# EAGLE design schem (EAGLE 7.6.0)
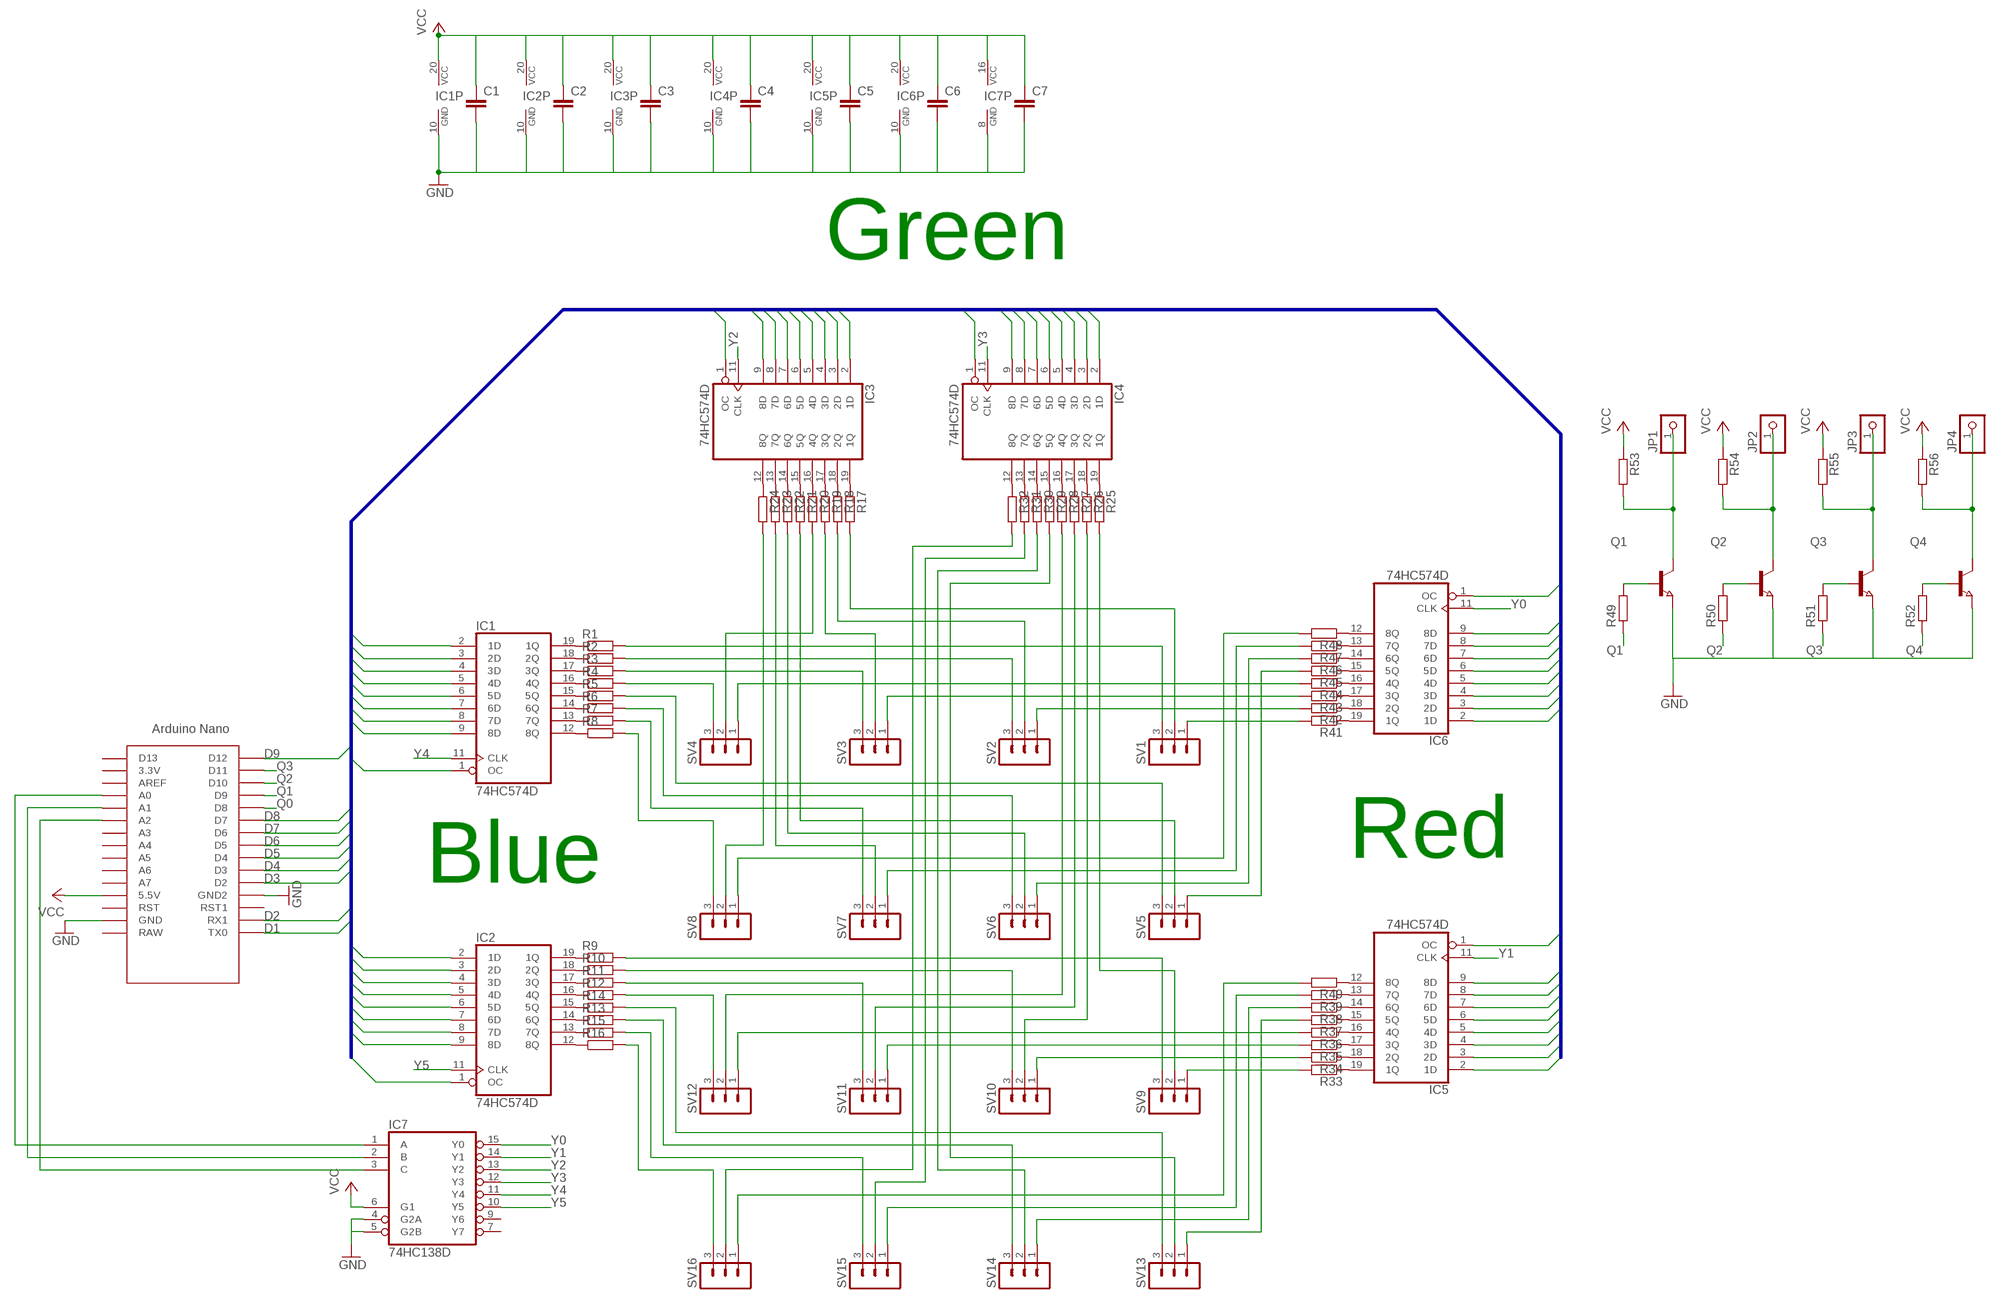
[diagram p0: schematic, sheet 1]

## Parts
C1  C-EUC0805  [C0805]
C2  C-EUC0805  [C0805]
C3  C-EUC0805  [C0805]
C4  C-EUC0805  [C0805]
C5  C-EUC0805  [C0805]
C6  C-EUC0805  [C0805]
C7  C-EUC0805  [C0805]
IC1  74HC574D  [SO20W]
IC2  74HC574D  [SO20W]
IC3  74HC574D  [SO20W]
IC4  74HC574D  [SO20W]
IC5  74HC574D  [SO20W]
IC6  74HC574D  [SO20W]
IC7  74HC138D  [SO16]
JP1  PINHD-1X1  [1X01]
JP2  PINHD-1X1  [1X01]
JP3  PINHD-1X1  [1X01]
JP4  PINHD-1X1  [1X01]
Q1  NPN-TRANSISTOR_SOT23  [SOT23]
Q2  NPN-TRANSISTOR_SOT23  [SOT23]
Q3  NPN-TRANSISTOR_SOT23  [SOT23]
Q4  NPN-TRANSISTOR_SOT23  [SOT23]
R1  R-EU_R0805  [R0805]
R2  R-EU_R0805  [R0805]
R3  R-EU_R0805  [R0805]
R4  R-EU_R0805  [R0805]
R5  R-EU_R0805  [R0805]
R6  R-EU_R0805  [R0805]
R7  R-EU_R0805  [R0805]
R8  R-EU_R0805  [R0805]
R9  R-EU_R0805  [R0805]
R10  R-EU_R0805  [R0805]
R11  R-EU_R0805  [R0805]
R12  R-EU_R0805  [R0805]
R13  R-EU_R0805  [R0805]
R14  R-EU_R0805  [R0805]
R15  R-EU_R0805  [R0805]
R16  R-EU_R0805  [R0805]
R17  R-EU_R0805  [R0805]
R18  R-EU_R0805  [R0805]
R19  R-EU_R0805  [R0805]
R20  R-EU_R0805  [R0805]
R21  R-EU_R0805  [R0805]
R22  R-EU_R0805  [R0805]
R23  R-EU_R0805  [R0805]
R24  R-EU_R0805  [R0805]
R25  R-EU_R0805  [R0805]
R26  R-EU_R0805  [R0805]
R27  R-EU_R0805  [R0805]
R28  R-EU_R0805  [R0805]
R29  R-EU_R0805  [R0805]
R30  R-EU_R0805  [R0805]
R31  R-EU_R0805  [R0805]
R32  R-EU_R0805  [R0805]
R33  R-EU_R0805  [R0805]
R34  R-EU_R0805  [R0805]
R35  R-EU_R0805  [R0805]
R36  R-EU_R0805  [R0805]
R37  R-EU_R0805  [R0805]
R38  R-EU_R0805  [R0805]
R39  R-EU_R0805  [R0805]
R40  R-EU_R0805  [R0805]
R41  R-EU_R0805  [R0805]
R42  R-EU_R0805  [R0805]
R43  R-EU_R0805  [R0805]
R44  R-EU_R0805  [R0805]
R45  R-EU_R0805  [R0805]
R46  R-EU_R0805  [R0805]
R47  R-EU_R0805  [R0805]
R48  R-EU_R0805  [R0805]
R49  R-EU_R0805  [R0805]
R50  R-EU_R0805  [R0805]
R51  R-EU_R0805  [R0805]
R52  R-EU_R0805  [R0805]
R53  R-EU_R0805  [R0805]
R54  R-EU_R0805  [R0805]
R55  R-EU_R0805  [R0805]
R56  R-EU_R0805  [R0805]
SV1  MA03-1  [MA03-1]
SV2  MA03-1  [MA03-1]
SV3  MA03-1  [MA03-1]
SV4  MA03-1  [MA03-1]
SV5  MA03-1  [MA03-1]
SV6  MA03-1  [MA03-1]
SV7  MA03-1  [MA03-1]
SV8  MA03-1  [MA03-1]
SV9  MA03-1  [MA03-1]
SV10  MA03-1  [MA03-1]
SV11  MA03-1  [MA03-1]
SV12  MA03-1  [MA03-1]
SV13  MA03-1  [MA03-1]
SV14  MA03-1  [MA03-1]
SV15  MA03-1  [MA03-1]
SV16  MA03-1  [MA03-1]
U$1  NANO  [NANO]

## Nets
D1: IC1.2(1D) IC2.2(1D) IC3.2(1D) IC4.2(1D) IC5.2(1D) IC6.2(1D) U$1.TX0
D2: IC1.3(2D) IC2.3(2D) IC3.3(2D) IC4.3(2D) IC5.3(2D) IC6.3(2D) U$1.RX1
D3: IC1.4(3D) IC2.4(3D) IC3.4(3D) IC4.4(3D) IC5.4(3D) IC6.4(3D) U$1.D2
D4: IC1.5(4D) IC2.5(4D) IC3.5(4D) IC4.5(4D) IC5.5(4D) IC6.5(4D) U$1.D3
D5: IC1.6(5D) IC2.6(5D) IC3.6(5D) IC4.6(5D) IC5.6(5D) IC6.6(5D) U$1.D4
D6: IC1.7(6D) IC2.7(6D) IC3.7(6D) IC4.7(6D) IC5.7(6D) IC6.7(6D) U$1.D5
D7: IC1.8(7D) IC2.8(7D) IC3.8(7D) IC4.8(7D) IC5.8(7D) IC6.8(7D) U$1.D6
D8: IC1.9(8D) IC2.9(8D) IC3.9(8D) IC4.9(8D) IC5.9(8D) IC6.9(8D) U$1.D7
D9: IC1.1(OC) IC2.1(OC) IC3.1(OC) IC4.1(OC) IC5.1(OC) IC6.1(OC) U$1.D12
GND: C1.2 C2.2 C3.2 C4.2 C5.2 C6.2 C7.2 IC1.10(GND) IC2.10(GND) IC3.10(GND) IC4.10(GND) IC5.10(GND) IC6.10(GND) IC7.4(G2A) IC7.5(G2B) IC7.8(GND) Q1.2(E) Q2.2(E) Q3.2(E) Q4.2(E) U$1.GND U$1.GND1(GND2)
N$1: IC1.19(1Q) R1.1
N$2: IC1.18(2Q) R2.1
N$3: IC1.17(3Q) R3.1
N$4: IC1.16(4Q) R4.1
N$5: IC1.15(5Q) R5.1
N$6: IC1.14(6Q) R6.1
N$7: IC1.13(7Q) R7.1
N$8: IC1.12(8Q) R8.1
N$9: IC2.19(1Q) R9.1
N$10: IC2.18(2Q) R10.1
N$11: IC2.17(3Q) R11.1
N$12: IC2.16(4Q) R12.1
N$13: IC2.14(6Q) R13.1
N$14: IC2.15(5Q) R14.1
N$15: IC2.13(7Q) R15.1
N$16: IC2.12(8Q) R16.1
N$17: IC3.19(1Q) R17.1
N$18: IC3.18(2Q) R18.1
N$19: IC3.17(3Q) R19.1
N$20: IC3.16(4Q) R20.1
N$21: IC3.15(5Q) R21.1
N$22: IC3.14(6Q) R22.1
N$23: IC3.13(7Q) R23.1
N$24: IC3.12(8Q) R24.1
N$25: IC4.19(1Q) R25.1
N$26: IC4.18(2Q) R26.1
N$27: IC4.17(3Q) R27.1
N$28: IC4.16(4Q) R28.1
N$29: IC4.15(5Q) R29.1
N$30: IC4.14(6Q) R30.1
N$31: IC4.13(7Q) R31.1
N$32: IC4.12(8Q) R32.1
N$33: IC5.19(1Q) R33.1
N$34: IC5.18(2Q) R34.1
N$35: IC5.17(3Q) R35.1
N$36: IC5.16(4Q) R36.1
N$37: IC5.15(5Q) R37.1
N$38: IC5.14(6Q) R38.1
N$39: IC5.13(7Q) R39.1
N$40: IC5.12(8Q) R40.1
N$41: IC6.19(1Q) R41.1
N$42: IC6.18(2Q) R42.1
N$43: IC6.17(3Q) R43.1
N$44: IC6.16(4Q) R44.1
N$45: IC6.15(5Q) R45.1
N$46: IC6.14(6Q) R46.1
N$47: IC6.13(7Q) R47.1
N$48: IC6.12(8Q) R48.1
N$49: R1.2 SV1.3
N$50: R2.2 SV2.3
N$51: R3.2 SV3.3
N$52: R4.2 SV4.3
N$53: R5.2 SV5.3
N$54: R6.2 SV6.3
N$55: R7.2 SV7.3
N$56: R8.2 SV8.3
N$57: R17.2 SV1.2
N$58: R18.2 SV2.2
N$59: R19.2 SV3.2
N$60: R20.2 SV4.2
N$61: R21.2 SV5.2
N$62: R22.2 SV6.2
N$63: R23.2 SV7.2
N$64: R24.2 SV8.2
N$65: R44.2 SV4.1
N$66: R43.2 SV3.1
N$67: R42.2 SV2.1
N$68: R41.2 SV1.1
N$69: R48.2 SV8.1
N$70: R9.2 SV9.3
N$71: R47.2 SV7.1
N$72: R46.2 SV6.1
N$73: R45.2 SV5.1
N$74: R10.2 SV10.3
N$75: R11.2 SV11.3
N$76: R12.2 SV12.3
N$77: R28.2 SV12.2
N$78: R27.2 SV11.2
N$79: R26.2 SV10.2
N$80: R25.2 SV9.2
N$81: R36.2 SV12.1
N$82: R35.2 SV11.1
N$83: R34.2 SV10.1
N$84: R33.2 SV9.1
N$85: R14.2 SV13.3
N$86: R13.2 SV14.3
N$87: R15.2 SV15.3
N$88: R16.2 SV16.3
N$89: R32.2 SV16.2
N$90: R31.2 SV15.2
N$91: R30.2 SV14.2
N$92: R29.2 SV13.2
N$93: R40.2 SV16.1
N$94: R39.2 SV15.1
N$95: R38.2 SV14.1
N$96: R37.2 SV13.1
N$97: IC7.1(A) U$1.A0
N$98: JP1.1 Q1.3(C) R53.2
N$99: JP2.1 Q2.3(C) R54.2
N$100: JP3.1 Q3.3(C) R55.2
N$101: JP4.1 Q4.3(C) R56.2
N$102: Q1.1(B) R49.2
N$103: Q2.1(B) R50.2
N$104: Q3.1(B) R51.2
N$105: Q4.1(B) R52.2
N$106: IC7.2(B) U$1.A1
N$107: IC7.3(C) U$1.A2
Q0: U$1.D8
Q1: R49.1 U$1.D9
Q2: R50.1 U$1.D10
Q3: R51.1 U$1.D11
Q4: R52.1
VCC: C1.1 C2.1 C3.1 C4.1 C5.1 C6.1 C7.1 IC1.20(VCC) IC2.20(VCC) IC3.20(VCC) IC4.20(VCC) IC5.20(VCC) IC6.20(VCC) IC7.6(G1) IC7.16(VCC) R53.1 R54.1 R55.1 R56.1 U$1.5V(5.5V)
Y0: IC6.11(CLK) IC7.15(Y0)
Y1: IC5.11(CLK) IC7.14(Y1)
Y2: IC3.11(CLK) IC7.13(Y2)
Y3: IC4.11(CLK) IC7.12(Y3)
Y4: IC1.11(CLK) IC7.11(Y4)
Y5: IC2.11(CLK) IC7.10(Y5)
Unconnected: IC7.7(Y7) IC7.9(Y6) U$1.3.3V U$1.A3 U$1.A4 U$1.A5 U$1.A6 U$1.A7 U$1.AREF U$1.D13 U$1.ICSP1 U$1.ICSP2 U$1.ICSP3 U$1.ICSP4 U$1.ICSP5 U$1.ICSP6 U$1.RAW U$1.RST U$1.RST1

## Buses
D[1..9]

## Notes on the sheet
- Green
- Red
- Blue

## Library data of the parts
C1-C7 = resistor:C-EU: CAPACITOR, European symbol
IC1-IC6 = 74xx-eu:74*574: 8-bit D type FLIP FLOP bus driver
IC7 = 74xx-eu:74*138: 3-line to 8-line DECODER/DEMULTIPLEXER
JP1-JP4 = pinhead:PINHD-1X1: PIN HEADER
Q1-Q4 = semicon-smd-ipc:NPN-TRANSISTOR_: NPN TRANSISTOR
R1-R56 = resistor:R-EU_: RESISTOR, European symbol
SV1-SV16 = con-lstb:MA03-1: PIN HEADER; OC_FARNELL: unknown; OC_NEWARK: unknown
U$1 = Arduino-clone:NANO: Arduino Nano

## Board
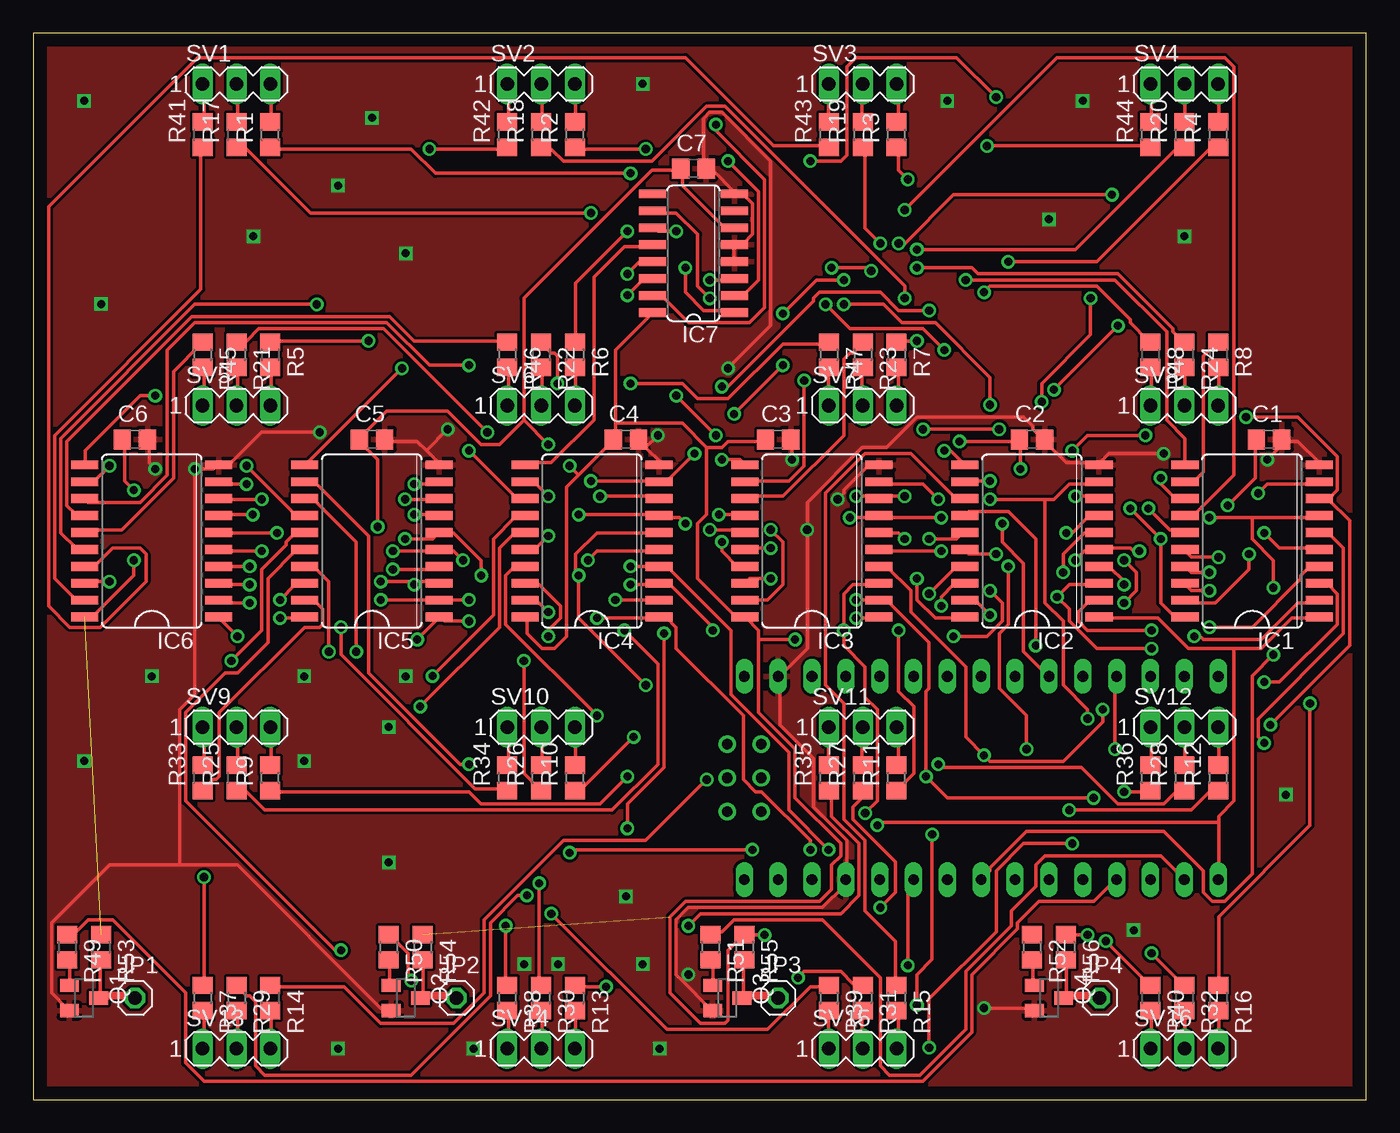
[diagram p1: board, top side]
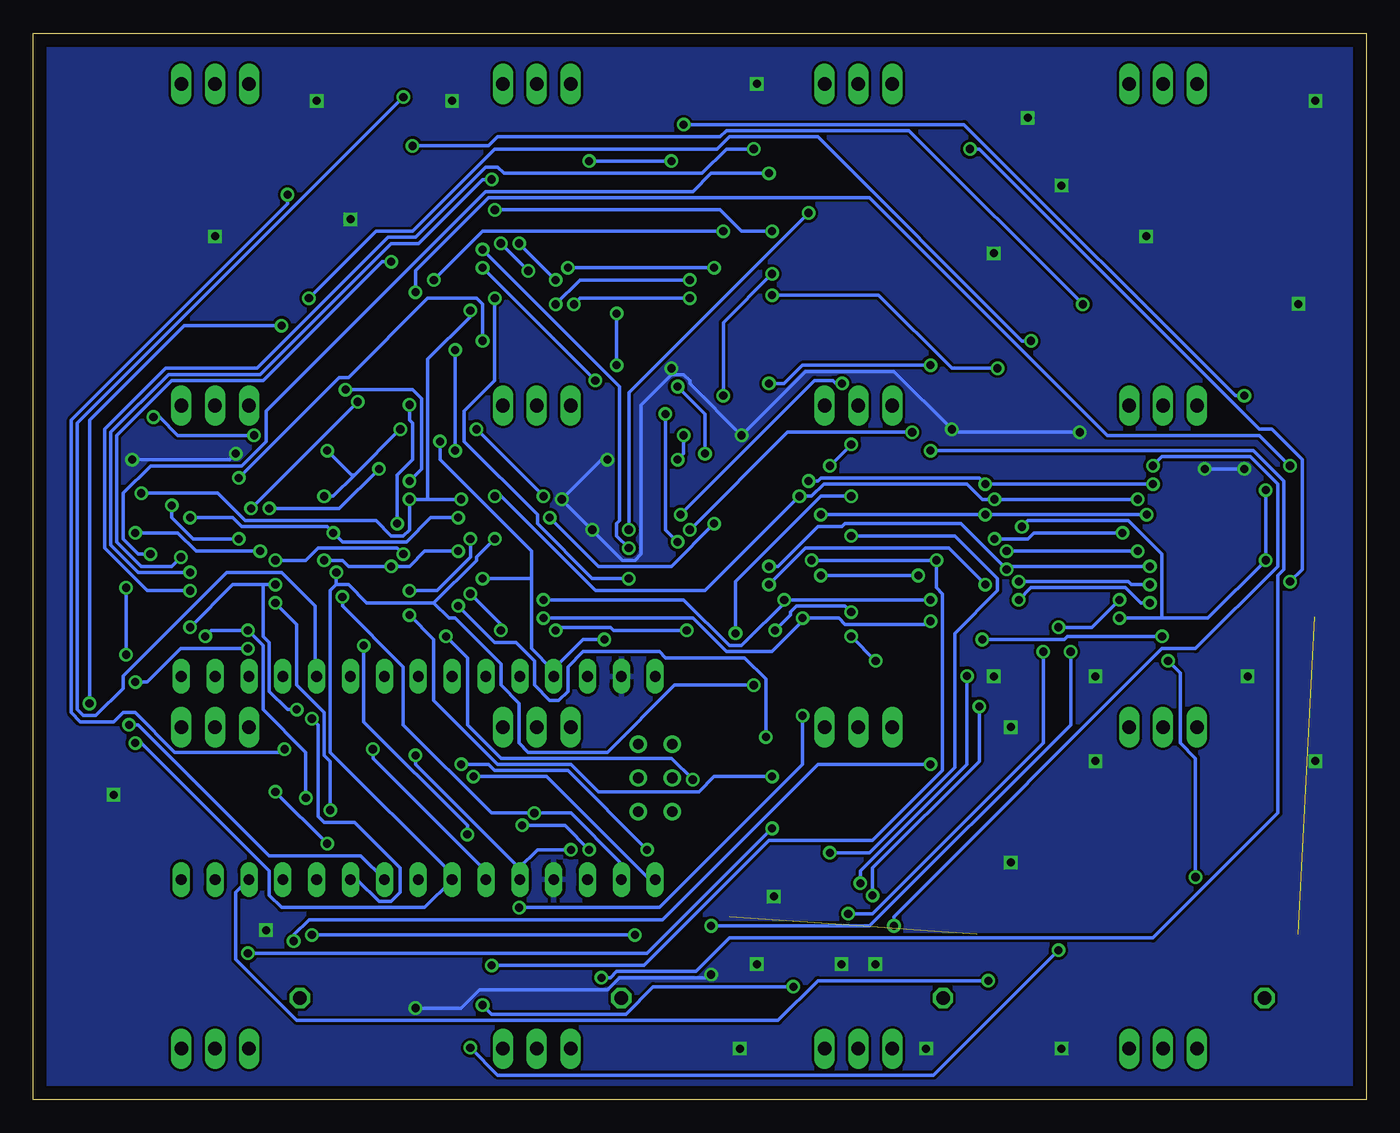
[diagram p2: board, bottom side, seen from below]

Size 100 x 80 mm. Coordinates in mm from the lower left corner, seen from the top.
Outline: 0,0 100,0 100,80 0,80 0,0
Copper layers (1*16): Top 0.035mm / dielectric 1.5mm / Bottom 0.035mm
Design rules "default *": minimum track width 10mil, minimum drill 24mil, track to track 8mil, track to pad 8mil, pad to pad 8mil, via to via 8mil, smd to smd 8mil, copper to edge 40mil, drill to drill 8mil, minimum pad ring 10mil, minimum via ring 8mil, stop-mask expansion 4mil, vias tented up to drill 0mil, thermal gap 10mil

### Footprints (pad centres in the part's own frame; a part is rotated, then mirrored left to right if it is on the bottom)
C0805 = smd 1.3 x 1.5: 1 -0.95,0; 2 0.95,0
SO20W = smd 0.66 x 2.032: 1 -5.715,-5.029; 2 -4.445,-5.029; 3 -3.175,-5.029; 4 -1.905,-5.029; 5 -0.635,-5.029; 6 0.635,-5.029; 7 1.905,-5.029; 8 3.175,-5.029; 9 4.445,-5.029; 10 5.715,-5.029; 11 5.715,5.029; 12 4.445,5.029; 13 3.175,5.029; 14 1.905,5.029; 15 0.635,5.029; 16 -0.635,5.029; 17 -1.905,5.029; 18 -3.175,5.029; 19 -4.445,5.029; 20 -5.715,5.029
SO16 = smd 0.66 x 2.032: 1 -4.445,-3.073; 2 -3.175,-3.073; 3 -1.905,-3.073; 4 -0.635,-3.073; 5 0.635,-3.073; 6 1.905,-3.073; 7 3.175,-3.073; 8 4.445,-3.073; 9 4.445,3.073; 10 3.175,3.073; 11 1.905,3.073; 12 0.635,3.073; 13 -0.635,3.073; 14 -1.905,3.073; 15 -3.175,3.073; 16 -4.445,3.073
1X01 = drill 1.016 octagon: 1 0,0
SOT23 = smd 1 x 1.4: 1 -0.95,-1.1; 2 0.95,-1.1; 3 0,1.1
R0805 = smd 1.3 x 1.5: 1 -0.95,0; 2 0.95,0
MA03-1 = drill 1.016 long: 1 -2.54,0; 2 0,0; 3 2.54,0
NANO = drill 0.8 long: 3.3V -10.16,24.13; 5V -10.16,-1.27; A0 -10.16,19.05; A1 -10.16,16.51; A2 -10.16,13.97; A3 -10.16,11.43; A4 -10.16,8.89; A5 -10.16,6.35; A6 -10.16,3.81; A7 -10.16,1.27; AREF -10.16,21.59; D2 5.08,1.27; D3 5.08,3.81; D4 5.08,6.35; D5 5.08,8.89; D6 5.08,11.43; D7 5.08,13.97; D8 5.08,16.51; D9 5.08,19.05; D10 5.08,21.59; D11 5.08,24.13; D12 5.08,26.67; D13 -10.16,26.67; GND -10.16,-6.35; GND1 5.08,-1.27; RAW -10.16,-8.89; RST -10.16,-3.81; RST1 5.08,-3.81; RX1 5.08,-6.35; TX0 5.08,-8.89 | drill 0.8: ICSP1 -5.08,-10.16; ICSP2 -5.08,-7.62; ICSP3 -2.54,-10.16; ICSP4 -2.54,-7.62; ICSP5 0,-10.16; ICSP6 0,-7.62

### Placement (x,y rotation side)
C1  92.71,49.53 0 top
C2  74.93,49.53 0 top
C3  55.88,49.53 0 top
C4  44.45,49.53 0 top
C5  25.4,49.53 0 top
C6  7.62,49.53 0 top
C7  49.53,69.85 0 top
IC1  91.44,41.91 90 top
IC2  74.93,41.91 90 top
IC3  58.42,41.91 90 top
IC4  41.91,41.91 90 top
IC5  25.4,41.91 90 top
IC6  8.89,41.91 90 top
IC7  49.53,63.5 90 top
JP1  7.62,7.62 0 top
JP2  31.75,7.62 0 top
JP3  55.88,7.62 0 top
JP4  80.01,7.62 0 top
Q1  3.81,7.62 270 top
Q2  27.94,7.62 270 top
Q3  52.07,7.62 270 top
Q4  76.2,7.62 270 top
R1  17.78,72.39 90 top
R2  40.64,72.39 90 top
R3  64.77,72.39 90 top
R4  88.9,72.39 90 top
R5  17.78,55.88 270 top
R6  40.64,55.88 270 top
R7  64.77,55.88 270 top
R8  88.9,55.88 270 top
R9  17.78,24.13 90 top
R10  40.64,24.13 90 top
R11  64.77,24.13 90 top
R12  88.9,24.13 90 top
R13  40.64,7.62 270 top
R14  17.78,7.62 270 top
R15  64.77,7.62 270 top
R16  88.9,7.62 270 top
R17  15.24,72.39 90 top
R18  38.1,72.39 90 top
R19  62.23,72.39 90 top
R20  86.36,72.39 90 top
R21  15.24,55.88 270 top
R22  38.1,55.88 270 top
R23  62.23,55.88 270 top
R24  86.36,55.88 270 top
R25  15.24,24.13 90 top
R26  38.1,24.13 90 top
R27  62.23,24.13 90 top
R28  86.36,24.13 90 top
R29  15.24,7.62 270 top
R30  38.1,7.62 270 top
R31  62.23,7.62 270 top
R32  86.36,7.62 270 top
R33  12.7,24.13 90 top
R34  35.56,24.13 90 top
R35  59.69,24.13 90 top
R36  83.82,24.13 90 top
R37  12.7,7.62 270 top
R38  35.56,7.62 270 top
R39  59.69,7.62 270 top
R40  83.82,7.62 270 top
R41  12.7,72.39 90 top
R42  35.56,72.39 90 top
R43  59.69,72.39 90 top
R44  83.82,72.39 90 top
R45  12.7,55.88 270 top
R46  35.56,55.88 270 top
R47  59.69,55.88 270 top
R48  83.82,55.88 270 top
R49  2.54,11.43 270 top
R50  26.67,11.43 270 top
R51  50.8,11.43 270 top
R52  74.93,11.43 270 top
R53  5.08,11.43 270 top
R54  29.21,11.43 270 top
R55  53.34,11.43 270 top
R56  77.47,11.43 270 top
SV1  15.24,76.2 0 top
SV2  38.1,76.2 0 top
SV3  62.23,76.2 0 top
SV4  86.36,76.2 0 top
SV5  15.24,52.07 0 top
SV6  38.1,52.07 0 top
SV7  62.23,52.07 0 top
SV8  86.36,52.07 0 top
SV9  15.24,27.94 0 top
SV10  38.1,27.94 0 top
SV11  62.23,27.94 0 top
SV12  86.36,27.94 0 top
SV13  15.24,3.81 0 top
SV14  38.1,3.81 0 top
SV15  62.23,3.81 0 top
SV16  86.36,3.81 0 top
U$1  62.23,21.59 270 top

### Tracks (layer width: path | path; a pad name or v marks a point on that pad's centre or on a via)
D1  (via drill 0.61)
  Top 0.254: v83.9,35.2 79.1,35.2 78.41,35.89 78.41,36.58 79.1,37.26 79.78,37.26 IC2.2 | v87.1,34.75 87.55,34.75 87.78,34.52 92.13,34.52 94.87,37.26 96.47,37.26 IC1.2 | v16.23,37.26 13.95,37.26 IC6.2 | v26.06,37.49 30.4,37.49 IC5.2 30.63,37.49 v32.69,37.49 | v43.66,37.49 46.86,37.49 IC4.2 | v61.72,37.49 63.32,37.49 IC3.2 63.55,37.26 64.24,37.26 67.21,34.29 67.21,30.86 66.98,30.63 v66.98,24.23 68.58,22.63 v79.55,22.63
  Bottom 0.254: v87.1,34.75 86.64,35.2 v83.9,35.2 82.75,34.06 82.75,29.26 79.55,26.06 v79.55,22.63 | v16.23,37.26 16.92,37.26 18.06,38.41 25.15,38.41 v26.06,37.49 | v32.69,37.49 43.43,37.49 | v61.72,37.49 51.21,37.49 47.78,34.06 46.86,34.06 43.43,37.49 | 43.43,37.49 v43.66,37.49 | v66.98,24.23 61.49,24.23 53.95,16.69 53.49,16.69 U$1.TX0
D2  (via drill 0.61)
  Top 0.254: v16.23,38.63 13.95,38.63 IC6.3 | 28.57,38.86 30.4,38.86 IC5.3 | 28.57,38.86 v26.06,38.86 | v44.81,38.63 46.86,38.63 IC4.3 47.09,38.63 47.78,38.63 50.98,35.43 v50.98,35.2 | 28.57,38.86 v28.57,38.63 | v62.41,21.49 63.32,22.4 63.32,29.26 62.41,30.18 62.41,32.46 60.81,34.06 v60.81,35.2 60.81,37.95 61.49,38.63 63.32,38.63 IC3.3 | IC2.3 79.78,38.63 77.72,38.63 v76.81,37.72 77.72,36.8 77.72,35.89 79.78,33.83 v83.9,33.83 | v92.35,31.32 93.5,31.32 97.84,35.66 97.84,37.95 97.16,38.63 96.47,38.63 IC1.3
  Bottom 0.254: v16.23,38.63 17.6,38.63 17.83,38.86 v26.06,38.86 | v44.81,38.63 42.06,41.38 31.32,41.38 v28.57,38.63 | U$1.RX1 56.01,16.69 56.01,17.83 59.66,21.49 v62.41,21.49 65.61,21.49 72.24,28.12 72.24,32.46 76.81,37.03 v76.81,37.72 | v92.35,31.32 91.44,31.32 88.92,33.83 v83.9,33.83 | v50.98,35.2 56.46,35.2 56.69,35.43 60.58,35.43 v60.81,35.2
D3  (via drill 0.61)
  Top 0.254: v16.23,40.01 IC6.4 | v26.98,39.78 30.18,39.78 30.4,40.01 IC5.4 | v44.81,40.01 IC4.4 47.55,40.01 52.35,35.2 52.35,30.4 56.69,26.06 56.69,21.72 v59.66,18.75 | IC2.4 80.7,40.01 81.84,38.86 v81.84,38.63 | v88.24,35.43 91.44,35.43 95.1,39.09 95.1,39.32 95.78,40.01 IC1.4 | IC3.4 64.01,40.01 65.84,38.18 65.84,36.58 69.95,32.46 69.95,27.2 v71.32,25.83 71.78,25.38 77.27,25.38 80.24,28.35 v80.24,29.26
  Bottom 0.254: v16.23,40.01 26.75,40.01 v26.98,39.78 30.4,43.2 39.09,43.2 39.32,42.98 41.15,42.98 44.12,40.01 v44.81,40.01 | 82.75,38.63 85.04,38.63 v88.24,35.43 | 82.75,38.63 v81.84,38.63 | v71.32,25.83 71.32,25.15 63.55,17.37 | 63.55,17.37 63.55,16.69 U$1.D2 63.55,17.37 | 82.75,38.63 82.75,34.75 82.3,34.29 82.3,30.63 80.92,29.26 v80.24,29.26 | v59.66,18.75 62.18,18.75 63.55,17.37
D4  (via drill 0.61)
  Top 0.254: v17.14,41.15 13.95,41.15 IC6.5 | v26.98,41.15 30.4,41.15 IC5.5 30.63,41.15 31.55,41.15 v32.23,40.46 | v41.6,40.46 42.29,41.15 46.86,41.15 IC4.5 | v68.12,41.15 63.55,41.15 IC3.5 | v78.18,40.46 78.87,41.15 79.78,41.15 IC2.5 80.01,41.38 82.3,41.38 82.53,41.15 v82.98,41.15 | v92.35,42.52 93.5,41.38 96.47,41.38 IC1.5 | v74.52,26.29 74.52,28.8 72.47,30.86 72.47,34.98 73.15,35.66 v73.15,40.01 | v65.61,10.06 65.61,16.23 65.84,16.46 U$1.D3
  Bottom 0.254: v26.98,41.15 v17.14,41.15 | v41.6,40.46 v32.23,40.46 32.23,38.41 31.77,37.95 31.77,24.69 37.03,19.43 44.81,19.43 54.18,10.06 v65.61,10.06 | v68.12,41.15 70.64,41.15 71.78,40.01 v73.15,40.01 76.35,40.01 76.81,40.46 v78.18,40.46 | v92.35,42.52 89.15,42.52 87.78,41.15 v82.98,41.15 | v74.52,26.29 74.52,25.6 66.06,17.14 66.06,16.69 U$1.D3
D5  (via drill 0.61)
  Top 0.254: v18.29,42.52 13.95,42.52 IC6.6 | v27.89,42.06 29.95,42.06 IC5.6 30.63,42.52 31.55,42.52 33.6,40.46 v33.6,39.32 | IC4.6 46.86,42.52 42.29,42.52 40.69,40.92 40.69,39.55 v40.92,39.32 40.92,36.12 v45.95,31.09 | v65.38,42.06 64.92,42.52 63.55,42.52 IC3.6 | v77.27,39.55 77.27,40.92 78.87,42.52 79.78,42.52 IC2.6 | v92.35,26.75 91.9,27.2 91.9,28.57 98.3,34.98 98.3,41.38 97.16,42.52 96.47,42.52 IC1.6
  Bottom 0.254: v18.29,42.52 24.92,42.52 25.38,42.06 v27.89,42.06 | v33.6,39.32 v40.92,39.32 | v65.38,42.06 66.75,40.69 66.75,40.46 69.95,37.26 | 69.95,37.26 74.98,37.26 76.35,38.63 77.27,38.63 | 77.27,38.63 77.72,38.18 77.72,26.06 68.58,16.92 U$1.D4 68.58,16.46 70.64,14.4 81.38,14.4 82.3,15.32 82.3,17.14 91.9,26.75 v92.35,26.75 | 77.27,38.63 v77.27,39.55 | v45.95,31.09 51.89,31.09 56.92,26.06 62.87,26.06 63.55,26.75 63.55,29.72 64.92,31.09 64.92,32.69 68.35,36.12 68.81,36.12 69.95,37.26
D6  (via drill 0.61)
  Top 0.254: v16.46,43.89 13.95,43.89 IC6.7 | v28.57,43.89 30.4,43.89 IC5.7 | v40.92,43.89 46.86,43.89 IC4.7 47.09,43.66 48.46,43.66 v48.92,43.2 | v68.12,43.66 63.55,43.66 IC3.7 63.32,43.66 v61.27,43.66 | v77.5,42.52 77.95,42.52 79.1,43.66 79.78,43.66 IC2.7 | v88.24,43.66 91.44,43.66 | 91.44,43.66 96.47,43.66 IC1.7 | v93.04,33.38 91.44,31.77 91.44,16.92 89.38,14.86 88.47,14.86 87.78,15.54 87.78,17.14 84.81,20.12 74.52,20.12 71.78,17.37 71.78,17.14 71.32,16.69 U$1.D5 | v93.04,38.41 93.04,40.46 91.44,42.06 91.44,43.66
  Bottom 0.254: v16.46,43.89 v28.57,43.89 v40.92,43.89 | v68.12,43.66 70.18,43.66 72.01,41.83 76.81,41.83 v77.5,42.52 77.95,42.98 84.35,42.98 85.04,43.66 v88.24,43.66 | v93.04,38.41 v93.04,33.38 | v48.92,43.2 52.12,40.01 57.61,40.01 v61.27,43.66
D7  (via drill 0.61)
  Top 0.254: 97.16,45.03 96.47,45.03 IC1.8 97.16,45.03 | 97.16,45.03 98.75,43.43 98.75,34.06 v92.81,28.12 | v17.14,45.03 13.95,45.03 IC6.8 | v27.89,45.03 30.4,45.03 IC5.8 | v42.52,45.26 46.86,45.26 IC4.8 | v65.38,45.26 63.55,45.26 IC3.8 63.32,45.26 v61.72,45.26 | v78.18,45.26 79.78,45.26 IC2.8 | v66.75,50.29 v72.47,50.29 | 97.16,45.03 97.84,45.72 97.84,48.23 94.87,51.21 v90.98,51.21 | v83.44,49.84 79.1,49.84 v77.95,48.69
  Bottom 0.254: v92.81,28.12 92.13,28.12 82.3,18.29 75.44,18.29 U$1.D6 | v17.14,45.03 v27.89,45.03 28.8,45.03 29.95,46.18 40.69,46.18 41.6,45.26 v42.52,45.26 49.61,38.18 57.84,38.18 64.92,45.26 v65.38,45.26 | v78.18,45.26 77.5,45.26 75.89,46.86 | v72.47,50.29 75.89,46.86 | v61.72,45.26 v66.75,50.29 | v90.98,51.21 90.53,51.21 89.15,49.84 v83.44,49.84 | v77.95,48.69 76.12,46.86 75.89,46.86
D8  (via drill 0.61)
  Top 0.254: v16,46.18 13.95,46.18 IC6.9 | v28.57,46.18 30.4,46.18 IC5.9 | v41.83,46.41 46.86,46.41 IC4.9 47.09,46.41 47.55,46.41 v49.61,48.46 | v67.89,45.03 66.75,46.18 63.55,46.18 IC3.9 | 75.89,45.03 76.58,45.03 77.72,46.18 79.78,46.18 IC2.9 | 75.89,45.03 v71.78,45.03 | v91.9,45.49 92.58,46.18 96.47,46.18 IC1.9 | v79.1,28.57 79.1,29.26 77.27,31.09 77.27,35.89 75.89,37.26 75.89,45.03 | v51.66,53.49 52.12,53.49 58.52,59.89 58.52,60.12 58.98,60.58 63.55,60.58 64.92,59.21 v67.21,59.21
  Bottom 0.254: v16,46.18 v28.57,46.18 29.03,46.63 40.92,46.63 41.15,46.41 v41.83,46.41 | 70.41,45.03 v71.78,45.03 71.78,42.75 72.24,42.29 73.15,42.29 74.3,43.43 84.12,43.43 86.18,45.49 v91.9,45.49 | 70.41,45.03 v67.89,45.03 | v79.1,28.57 78.64,28.12 78.64,21.26 78.18,20.8 75.89,20.8 72.47,17.37 72.47,15.54 73.15,14.86 74.07,14.86 75.67,16.46 76.12,16.46 U$1.D7 | v49.61,48.46 49.61,51.44 v51.66,53.49 | v67.21,59.21 67.21,58.75 70.41,55.55 70.41,45.03
D9  (via drill 0.61)
  Top 0.254: 90.07,33.83 92.13,33.83 94.41,36.12 96.47,36.12 IC1.1 | 90.07,33.83 86.64,33.83 84.35,36.12 80.01,36.12 IC2.1 | 88.92,20.8 88.92,21.26 90.07,22.4 90.07,33.83 | 88.92,20.8 88.92,16.69 U$1.D12 | v15.32,34.75 13.95,36.12 IC6.1 | v28.8,34.52 30.4,36.12 IC5.1 30.63,36.12 30.86,35.89 v32.69,35.89 | v42.29,36.12 46.86,36.12 IC4.1 47.09,36.12 47.55,36.12 48.23,35.43 48.23,33.83 53.26,28.8 53.26,24 54.18,23.09 54.63,23.09 58.29,19.43 v58.29,18.75 | v61.72,36.12 63.32,36.12 IC3.1 | 88.92,20.8 63.55,20.8 v63.32,20.57
  Bottom 0.254: v15.32,34.75 22.4,34.75 22.63,34.52 v28.8,34.52 | 42.06,36.12 39.55,36.12 39.09,35.66 32.92,35.66 v32.69,35.89 | v61.72,36.12 50.52,36.12 48.01,33.6 44.58,33.6 42.06,36.12 | 42.06,36.12 v42.29,36.12 | v63.32,20.57 60.12,20.57 v58.29,18.75
GND  (via drill 0.6, 0.61)
  Top 0.254: IC1.10 96.47,47.78 94.87,49.38 93.73,49.38 C1.2 93.5,49.38 93.5,48.92 v92.58,48.01 | v84.81,48.46 80.7,48.46 80.01,47.78 IC2.10 79.78,47.78 77.5,47.78 75.89,49.38 C2.2 75.67,49.61 74.98,50.29 74.98,50.52 74.3,51.21 66.29,51.21 64.01,48.92 62.18,48.92 58.06,44.81 v58.06,42.75 58.06,33.83 56.01,31.77 U$1.GND 56.01,31.55 56.01,28.12 58.52,25.6 58.52,21.95 61.04,19.43 61.04,16.69 U$1.GND1 60.81,16.46 60.81,16 59.21,14.4 49.15,14.4 48.23,13.49 48.23,9.37 48.69,8.91 | 48.69,8.91 50.75,6.86 Q3.2 | v71.32,6.86 74.98,6.86 Q4.2 | 48.69,8.91 v49.15,9.37 | v9.14,47.32 8.69,47.78 8.69,49.38 C6.2 | 10.97,17.6 15.32,17.6 26.06,6.86 26.75,6.86 Q2.2 | 10.97,17.6 5.71,17.6 1.37,13.26 1.37,8 2.52,6.86 Q1.2 | 10.97,17.6 10.97,29.26 12.12,30.4 v12.12,47.32 13.49,47.32 13.72,47.55 IC6.10 13.95,47.78 14.86,47.78 17.14,50.06 v21.49,50.06 | IC7.4 52.58,62.87 52.58,64.01 IC7.5 52.81,64.24 53.26,64.24 53.95,64.92 53.95,67.21 53.26,67.89 52.81,67.89 IC7.8 52.58,68.12 50.98,69.72 50.52,69.72 C7.2 50.29,69.95 50.29,73.61 50.75,74.07 51.66,74.07 55.32,70.41 55.32,58.06 v52.12,54.86 | 29.49,48.69 30.4,47.78 IC5.10 | 29.49,48.69 28.8,49.38 26.52,49.38 C5.2 | 45.95,48.92 47.09,47.78 IC4.10 | 45.95,48.92 45.49,49.38 C4.2 45.95,48.92 | v56.92,48.01 56.92,49.38 C3.2 | v60.35,45.03 60.81,45.49 60.81,45.72 62.64,47.55 63.32,47.55 IC3.10 | v46.86,49.84 45.95,48.92 | v31.09,50.29 29.49,48.69
  Bottom 0.254: v92.58,48.01 85.27,48.01 v84.81,48.46 | v71.32,6.86 67.89,6.86 66.52,8.23 56.92,8.23 56.01,9.14 49.38,9.14 v49.15,9.37 | v12.12,47.32 v9.14,47.32 | v56.92,48.01 57.38,48.01 v60.35,45.03 v58.06,42.75 55.78,40.46 54.86,40.46 54.41,40.92 54.41,52.12 52.12,54.41 | 52.12,54.41 51.21,54.41 50.75,53.95 50.75,53.72 v46.86,49.84 42.06,54.63 35.43,54.63 v31.09,50.29 30.86,50.06 v21.49,50.06 | 52.12,54.41 v52.12,54.86
  other vias: 26.67,17.78 8.89,31.75 3.81,25.4 5.08,59.69 16.51,64.77 27.94,63.5 22.86,68.58 25.4,73.66 3.81,74.93 45.72,76.2 68.58,74.93 78.74,74.93 86.36,64.77 76.2,66.04 22.86,3.81 45.72,10.16 44.45,15.24 46.99,3.81 33.02,3.81 93.98,22.86 20.32,25.4 26.67,27.94 27.94,31.75 20.32,31.75 82.55,12.7 39.37,10.16 36.83,10.16
  pour Top: 0,80.01 0,0 100.33,0 100.33,80.01
  pour Bottom: 0,80.01 0,0 100.33,0 100.33,80.01
N$1  (via drill 0.61)
  Top 0.254: v44.81,69.49 30.18,69.49 28.35,71.32 17.83,71.32 R1.1 | v91.21,40.92 91.21,39.78 88.7,37.26 86.41,37.26 IC1.19
  Bottom 0.254: v44.81,69.49 49.15,69.49 50.52,68.12 66.06,68.12 82.53,51.66 82.53,49.38 84.35,47.55 91.21,47.55 93.27,45.49 93.27,42.06 92.13,40.92 v91.21,40.92
N$2  (via drill 0.61)
  Top 0.254: v45.95,71.32 40.69,71.32 R2.1 | v88.24,38.18 86.87,38.18 86.41,38.63 IC1.18
  Bottom 0.254: v45.95,71.32 48.01,71.32 49.84,69.49 64.69,69.49 65.15,69.95 66.06,69.95 71.32,64.69 73.38,64.69 83.21,54.86 90.07,54.86 94.64,50.29 94.64,41.38 91.44,38.18 v88.24,38.18
N$3  (via drill 0.61)
  Top 0.254: v65.61,69.04 64.92,69.72 64.92,71.32 R3.1 | v88.24,39.55 86.87,39.55 IC1.17
  Bottom 0.254: v65.61,69.04 66.29,69.04 71.09,64.24 73.15,64.24 82.98,54.41 89.84,54.41 94.18,50.06 94.18,41.6 92.13,39.55 v88.24,39.55
N$4  (via drill 0.61)
  Top 0.254: v73.15,62.87 79.78,62.87 88.24,71.32 88.7,71.32 R4.1 | v88.92,40.69 86.87,40.69 86.41,41.15 IC1.16
  Bottom 0.254: v73.15,62.87 73.84,62.87 82.75,53.95 89.61,53.95 93.73,49.84 93.73,41.83 91.9,40.01 89.61,40.01 v88.92,40.69
N$5  (via drill 0.61)
  Top 0.254: v25.15,56.92 17.83,56.92 R5.1 | v79.32,60.12 79.32,57.38 75.67,53.72 v75.67,52.35 | v83.67,44.35 85.27,42.75 86.41,42.75 IC1.15
  Bottom 0.254: v25.15,56.92 25.83,56.92 41.15,72.24 47.78,72.24 48.69,71.32 65.38,71.32 71.55,65.15 74.3,65.15 v79.32,60.12 | v83.67,44.35 v75.67,52.35
N$6  (via drill 0.61)
  Top 0.254: v44.58,65.15 40.69,61.27 40.69,56.92 R6.1 | v65.38,66.75 76.81,78.18 89.38,78.18 90.07,77.5 90.07,46.86 87.1,43.89 86.41,43.89 IC1.14
  Bottom 0.254: v44.58,65.15 46.86,65.15 48.46,66.75 v65.38,66.75
N$7  (via drill 0.61)
  Top 0.254: v66.29,56.92 64.92,56.92 R7.1 | v84.58,46.63 84.58,46.18 85.5,45.26 86.41,45.26 IC1.13
  Bottom 0.254: v66.29,56.92 66.29,59.66 66.75,60.12 70.41,60.12 76.35,54.18 77.04,54.18 v84.58,46.63
N$8
  Top 0.254: R8.1 88.7,56.69 87.78,55.78 87.78,47.09 87.1,46.41 86.41,46.41 IC1.12
N$9  (via drill 0.61)
  Top 0.254: v44.58,24.23 42.52,22.17 33.6,22.17 32.69,23.09 17.83,23.09 R9.1 | v71.78,36.35 70.87,37.26 69.95,37.26 IC2.19
  Bottom 0.254: v44.58,24.23 48.92,24.23 50.06,23.09 57.61,23.09 59.66,25.15 65.15,25.15 69.95,29.95 69.95,34.52 v71.78,36.35
N$10  (via drill 0.61)
  Top 0.254: v45.03,27.2 41.15,23.32 40.69,23.32 R10.1 | v68.12,37.03 68.12,37.72 69.04,38.63 69.72,38.63 IC2.18
  Bottom 0.254: v45.03,27.2 45.03,31.55 46.63,33.15 52.58,33.15 53.03,33.6 58.75,33.6 59.89,32.46 59.89,30.63 60.58,29.95 61.27,29.95 62.41,31.09 62.41,32.92 63.78,34.29 65.38,34.29 v68.12,37.03
N$11  (via drill 0.61)
  Top 0.254: v64.92,35.2 64.92,30.63 66.06,29.49 66.06,24.46 64.92,23.32 R11.1 | v67.21,37.95 69.27,40.01 IC2.17
  Bottom 0.254: v64.92,35.2 64.92,35.66 v67.21,37.95
N$12  (via drill 0.61)
  Top 0.254: v77.72,21.72 86.87,21.72 88.24,23.09 88.7,23.09 R12.1 | v81.84,37.26 82.75,38.18 82.75,39.55 v81.84,40.46 | v72.24,40.92 70.18,40.92 69.95,41.15 IC2.16
  Bottom 0.254: v77.72,21.72 77.72,25.38 78.18,25.83 78.18,29.03 80.24,31.09 80.24,35.66 v81.84,37.26 | v81.84,40.46 79.55,40.46 78.64,41.38 72.69,41.38 v72.24,40.92
N$13  (via drill 0.61)
  Top 0.254: v42.98,8.46 40.69,8.46 R13.1 | v66.29,7.09 66.29,9.37 67.44,10.52 v67.44,19.89 | v75.21,34.06 75.21,42.06 73.15,44.12 70.18,44.12 69.95,43.89 IC2.14
  Bottom 0.254: v42.98,8.46 53.49,8.46 55.55,6.4 65.61,6.4 v66.29,7.09 | v67.44,19.89 67.44,20.57 75.21,28.35 v75.21,34.06
N$14  (via drill 0.61)
  Top 0.254: v50.52,24 45.95,19.43 39.78,19.43 33.83,13.49 33.83,8 31.55,5.71 26.06,5.71 23.32,8.46 17.83,8.46 R14.1 | v69.04,34.75 71.55,34.75 72.69,35.89 72.69,37.26 v71.78,38.18 | v67.21,42.06 69.27,42.06 69.72,42.52 IC2.15
  Bottom 0.254: v50.52,24 52.12,25.6 64.92,25.6 67.44,28.12 67.44,33.15 v69.04,34.75 | v71.78,38.18 69.72,38.18 67.21,40.69 v67.21,42.06
N$15
  Top 0.254: R15.1 64.69,8.69 64.69,11.89 62.41,14.17 62.41,19.43 60.81,21.03 60.81,29.72 59.44,31.09 59.44,45.49 62.41,48.46 65.84,48.46 69.04,45.26 69.72,45.26 IC2.13
N$16  (via drill 0.61)
  Top 0.254: v95.78,29.72 95.78,20.57 88.92,13.72 88.92,8.69 R16.1 | v76.58,53.26 v81.38,58.06 | v71.78,46.41 69.95,46.41 IC2.12
  Bottom 0.254: v95.78,29.72 95.78,50.98 88.7,58.06 v81.38,58.06 | v76.58,53.26 71.55,53.26 70.87,52.58 70.87,47.32 v71.78,46.41
N$17  (via drill 0.61)
  Top 0.254: v41.83,66.52 20.8,66.52 16,71.32 15.32,71.32 R17.1 | v55.32,42.75 56.24,41.83 56.24,38.63 55.09,37.49 53.49,37.49 IC3.19
  Bottom 0.254: v41.83,66.52 55.32,53.03 v55.32,42.75
N$18  (via drill 0.61)
  Top 0.254: v65.38,60.12 65.38,61.04 51.89,74.52 50.52,74.52 46.41,70.41 39.78,70.41 38.86,71.32 38.18,71.32 R18.1 | v55.32,39.09 53.72,39.09 53.49,38.86 IC3.18
  Bottom 0.254: v65.38,60.12 65.38,53.95 67.67,51.66 67.67,49.38 62.18,43.89 62.18,43.2 58.06,39.09 v55.32,39.09
N$19  (via drill 0.61)
  Top 0.254: v63.55,64.24 62.41,65.38 62.41,71.32 R19.1 | v60.81,61.49 58.75,61.49 v56.24,58.98 | v52.58,51.44 v56.24,55.09 | v51.66,41.83 51.66,41.15 52.81,40.01 IC3.17
  Bottom 0.254: v60.81,61.49 v63.55,64.24 | v56.24,55.09 v56.24,58.98 | v52.58,51.44 52.58,42.75 v51.66,41.83
N$20  (via drill 0.61)
  Top 0.254: v66.29,63.78 78.18,63.78 85.72,71.32 86.18,71.32 R20.1 | v55.32,41.38 53.49,41.38 IC3.16
  Bottom 0.254: v66.29,63.78 56.01,53.49 56.01,43.43 56.24,43.2 56.24,42.29 v55.32,41.38
N$21  (via drill 0.61)
  Top 0.254: v34.06,50.06 26.29,57.84 16.92,57.84 16,56.92 15.32,56.92 R21.1 | v50.75,42.75 53.26,42.75 IC3.15
  Bottom 0.254: v34.06,50.06 43.43,50.06 v50.75,42.75
N$22  (via drill 0.61)
  Top 0.254: v39.32,53.72 39.32,55.78 39.09,56.01 38.86,56.01 38.18,56.69 R22.1 | v51.44,43.89 53.26,43.89 IC3.14
  Bottom 0.254: v39.32,53.72 39.78,53.72 40.01,53.95 41.38,53.95 v51.44,43.89
N$23
  Top 0.254: R23.1 62.18,56.69 61.49,56.01 61.27,56.01 60.81,55.55 60.81,49.84 56.24,45.26 53.49,45.26 IC3.13
N$24  (via drill 0.61)
  Top 0.254: v66.29,62.41 70.41,62.41 70.87,61.95 81.38,61.95 85.5,57.84 85.5,57.61 86.18,56.92 R24.1 | v57.84,53.95 57.84,47.55 56.69,46.41 53.49,46.41 IC3.12
  Bottom 0.254: v57.84,53.95 v66.29,62.41
N$25  (via drill 0.61)
  Top 0.254: v44.35,35.2 46.86,32.69 46.86,25.15 43.43,21.72 17.37,21.72 16,23.09 15.32,23.09 R25.1 | v38.63,36.58 37.95,37.26 37.03,37.26 IC4.19
  Bottom 0.254: v44.35,35.2 43.2,36.35 43.2,36.58 42.75,37.03 39.09,37.03 v38.63,36.58
N$26  (via drill 0.61)
  Top 0.254: v36.8,32.92 36.8,24.46 37.95,23.32 R26.1 | v38.63,34.75 38.63,35.2 39.55,36.12 39.55,37.03 37.95,38.63 37.03,38.63 IC4.18
  Bottom 0.254: v38.63,34.75 v36.8,32.92
N$27  (via drill 0.61)
  Top 0.254: v63.55,14.4 64.69,15.54 64.69,17.83 61.49,21.03 61.49,21.95 62.18,22.63 62.18,23.09 R27.1 | v42.29,28.8 35.43,35.66 35.43,39.32 36.12,40.01 IC4.17
  Bottom 0.254: v63.55,14.4 53.03,14.4 42.29,25.15 v42.29,28.8
N$28  (via drill 0.61)
  Top 0.254: v67.89,25.15 68.12,24.92 78.64,24.92 81.38,22.17 84.81,22.17 85.72,23.09 86.18,23.09 R28.1 | v53.95,18.75 40.46,18.75 v40.23,18.52 | v38.63,42.29 37.72,41.38 37.03,41.38 IC4.16
  Bottom 0.254: v67.89,25.15 65.84,25.15 65.38,24.69 59.89,24.69 v53.95,18.75 | v40.23,18.52 37.26,18.52 30.86,24.92 30.86,34.98 27.66,38.18 27.66,39.09 30.86,42.29 v38.63,42.29
N$29  (via drill 0.61)
  Top 0.254: v37.03,15.32 36.35,15.32 34.29,13.26 34.29,7.77 28.35,1.83 17.37,1.83 16.69,2.52 16.69,7.32 16.23,7.77 16,7.77 15.32,8.46 R29.1 | v29.03,29.49 34.98,35.43 34.98,41.38 36.12,42.52 36.8,42.52 IC4.15
  Bottom 0.254: v37.03,15.32 37.03,17.37 29.03,25.38 v29.03,29.49
N$30  (via drill 0.61)
  Top 0.254: v37.95,16.23 37.95,8.69 R30.1 | v29.95,31.77 34.52,36.35 34.52,42.06 36.12,43.66 36.8,43.66 IC4.14
  Bottom 0.254: v37.95,16.23 37.95,17.14 29.95,25.15 v29.95,31.77
N$31  (via drill 0.61)
  Top 0.254: v57.38,9.14 57.84,9.6 60.58,9.6 61.49,8.69 62.18,8.69 R31.1 | v32.69,48.69 36.12,45.26 36.8,45.26 IC4.13
  Bottom 0.254: v57.38,9.14 56.69,9.14 56.24,9.6 50.29,9.6 47.78,12.12 16,12.12 6.63,21.49 6.63,39.32 6.17,39.78 6.17,46.41 8.46,48.69 v32.69,48.69
N$32  (via drill 0.61)
  Top 0.254: v83.9,10.97 86.18,8.69 R32.1 | v44.58,20.34 44.58,22.17 47.32,24.92 v47.32,34.98 | v38.63,45.26 37.72,46.18 37.03,46.18 IC4.12
  Bottom 0.254: v83.9,10.97 53.95,10.97 v44.58,20.34 | v47.32,34.98 47.32,38.86 40.92,45.26 v38.63,45.26
N$33
  Top 0.254: R33.1 12.8,23.32 13.49,24 13.72,24 13.95,24.23 13.95,29.03 20.34,35.43 21.49,35.43 21.72,35.66 21.72,36.8 21.26,37.26 20.57,37.26 IC5.19
N$34  (via drill 0.61)
  Top 0.254: v23.09,35.43 23.09,33.38 33.15,23.32 35.43,23.32 R34.1 | v18.52,37.49 19.66,38.63 20.34,38.63 IC5.18
  Bottom 0.254: v23.09,35.43 20.57,35.43 v18.52,37.49
N$35  (via drill 0.61)
  Top 0.254: v49.15,13.03 50.06,13.95 60.58,13.95 61.95,15.32 61.95,19.2 59.89,21.26 59.89,23.09 R35.1 | v22.17,33.6 22.17,38.86 21.03,40.01 IC5.17
  Bottom 0.254: v49.15,13.03 37.26,13.03 22.17,28.12 v22.17,33.6
N$36  (via drill 0.61)
  Top 0.254: v81.84,23.09 83.67,23.09 R36.1 | v77.95,19.2 74.3,19.2 72.24,17.14 72.24,12.57 67.21,7.54 v67.21,3.89 | v23.09,11.2 22.63,11.2 11.43,22.4 11.43,29.03 14.4,32 15.32,32 17.6,34.29 17.6,39.09 19.66,41.15 20.34,41.15 IC5.16
  Bottom 0.254: v77.95,19.2 v81.84,23.09 | v67.21,3.89 65.15,1.83 32.46,1.83 v23.09,11.2
N$37  (via drill 0.61)
  Top 0.254: v12.8,16.69 12.8,8.69 R37.1 | v14.86,32.92 17.14,35.2 17.14,39.78 18.97,41.6 18.97,41.83 19.66,42.52 20.34,42.52 IC5.15
  Bottom 0.254: v12.8,16.69 12.8,25.6 13.95,26.75 13.95,32 v14.86,32.92
N$38  (via drill 0.61)
  Top 0.254: v35.43,13.03 35.43,8.69 R38.1 | v16,47.55 19.66,43.89 20.34,43.89 IC5.14
  Bottom 0.254: v35.43,13.03 35.43,13.72 15.32,33.83 12.8,33.83 6.63,40.01 6.63,46.18 8.69,48.23 15.32,48.23 v16,47.55
N$39  (via drill 0.61)
  Top 0.254: v38.86,13.95 47.55,5.26 55.09,5.26 58.29,8.46 59.66,8.46 R39.1 | v24.23,33.6 24.23,41.83 21.03,45.03 20.57,45.03 IC5.13
  Bottom 0.254: v38.86,13.95 37.03,13.95 24.23,26.75 v24.23,33.6
N$40  (via drill 0.61)
  Top 0.254: v80.47,11.89 83.67,8.69 R40.1 | v32.69,25.15 32,25.15 25.15,32 25.15,42.29 21.26,46.18 20.57,46.18 IC5.12
  Bottom 0.254: v80.47,11.89 80.47,12.34 79.32,13.49 52.81,13.49 41.15,25.15 v32.69,25.15
N$41
  Top 0.254: 12.57,60.81 12.57,71.32 | 12.57,60.81 1.6,49.84 1.6,39.09 3.2,37.49 3.66,37.49 IC6.19 | 12.57,71.32 R41.1 | 12.57,60.81 12.57,71.32
N$42  (via drill 0.61)
  Top 0.254: v29.72,71.32 35.43,71.32 R42.1 | v5.71,38.86 3.89,38.86 IC6.18
  Bottom 0.254: v29.72,71.32 29.03,71.32 8,50.29 7.09,50.29 4.8,48.01 4.8,39.78 v5.71,38.86
N$43
  Top 0.254: IC6.17 4.57,40.01 5.94,41.38 8,41.38 8.46,40.92 8.46,38.86 5.03,35.43 2.74,35.43 1.14,37.03 1.14,66.98 12.34,78.18 48.92,78.18 55.55,71.55 59.66,71.55 R43.1
N$44  (via drill 0.61)
  Top 0.254: v71.55,71.55 83.67,71.55 R44.1 | v21.26,59.66 12.12,59.66 2.06,49.61 2.06,42.52 3.2,41.38 3.66,41.38 IC6.16
  Bottom 0.254: v71.55,71.55 65.84,71.55 65.15,72.24 48.46,72.24 48.01,72.69 34.29,72.69 v21.26,59.66
N$45
  Top 0.254: R45.1 12.57,56.69 10.52,54.63 10.52,46.63 6.63,42.75 3.89,42.75 IC6.15
N$46
  Top 0.254: R46.1 35.43,56.92 28.57,56.92 26.75,58.75 11.89,58.75 2.52,49.38 2.52,44.58 3.2,43.89 3.66,43.89 IC6.14
N$47  (via drill 0.61)
  Top 0.254: v44.81,53.72 48.69,53.72 49.84,52.58 52.12,52.58 56.24,56.69 59.66,56.69 R47.1 | v32.69,55.09 29.72,55.09 26.52,58.29 12.12,58.29 10.06,56.24 10.06,46.86 8,44.81 4.12,44.81 3.89,45.03 IC6.13
  Bottom 0.254: v44.81,53.72 43.66,53.72 42.29,55.09 v32.69,55.09
N$48  (via drill 0.61)
  Top 0.254: v71.32,60.58 71.78,61.04 79.78,61.04 82.3,58.52 82.3,58.29 83.67,56.92 R48.1 | v5.71,47.55 4.57,46.41 3.89,46.41 IC6.12
  Bottom 0.254: v71.32,60.58 71.32,62.18 65.84,67.67 37.26,67.67 19.43,49.84 8,49.84 v5.71,47.55
N$49
  Top 0.254: R1.2 17.83,73.38 17.83,76.12 SV1.3
N$50
  Top 0.254: R2.2 40.69,73.38 40.69,76.12 SV2.3
N$51
  Top 0.254: R3.2 64.92,73.38 64.92,76.12 SV3.3
N$52
  Top 0.254: R4.2 88.92,73.38 88.92,76.12 SV4.3
N$53
  Top 0.254: R5.2 17.83,54.86 17.83,52.12 SV5.3
N$54
  Top 0.254: R6.2 40.69,54.86 40.69,52.12 SV6.3
N$55
  Top 0.254: R7.2 64.92,54.86 64.92,52.12 SV7.3
N$56
  Top 0.254: R8.2 88.92,54.86 88.92,52.12 SV8.3
N$57
  Top 0.254: R17.2 15.32,73.38 15.32,76.12 SV1.2
N$58
  Top 0.254: R18.2 38.18,73.38 38.18,76.12 SV2.2
N$59
  Top 0.254: R19.2 62.18,73.38 62.18,76.12 SV3.2
N$60
  Top 0.254: R20.2 86.41,73.38 86.41,76.12 SV4.2
N$61
  Top 0.254: R21.2 15.32,54.86 15.32,52.12 SV5.2
N$62
  Top 0.254: R22.2 38.18,54.86 38.18,52.12 SV6.2
N$63
  Top 0.254: R23.2 62.18,54.86 62.18,52.12 SV7.2
N$64
  Top 0.254: R24.2 86.41,54.86 86.41,52.12 SV8.2
N$65
  Top 0.254: R44.2 83.9,73.38 83.9,76.12 SV4.1
N$66
  Top 0.254: R43.2 59.66,73.38 59.66,76.12 SV3.1
N$67
  Top 0.254: R42.2 35.66,73.38 35.66,76.12 SV2.1
N$68
  Top 0.254: R41.2 12.8,73.38 12.8,76.12 SV1.1
N$69
  Top 0.254: R48.2 83.9,54.86 83.9,52.12 SV8.1
N$70
  Top 0.254: R9.2 17.83,25.15 17.83,27.89 SV9.3
N$71
  Top 0.254: R47.2 59.66,54.86 59.66,52.12 SV7.1
N$72
  Top 0.254: R46.2 35.66,54.86 35.66,52.12 SV6.1
N$73
  Top 0.254: R45.2 12.8,54.86 12.8,52.12 SV5.1
N$74
  Top 0.254: R10.2 40.69,25.15 40.69,27.89 SV10.3
N$75
  Top 0.254: R11.2 64.92,25.15 64.92,27.89 SV11.3
N$76
  Top 0.254: R12.2 88.92,25.15 88.92,27.89 SV12.3
N$77
  Top 0.254: R28.2 86.41,25.15 86.41,27.89 SV12.2
N$78
  Top 0.254: R27.2 62.18,25.15 62.18,27.89 SV11.2
N$79
  Top 0.254: R26.2 38.18,25.15 38.18,27.89 SV10.2
N$80
  Top 0.254: R25.2 15.32,25.15 15.32,27.89 SV9.2
N$81
  Top 0.254: R36.2 83.9,25.15 83.9,27.89 SV12.1
N$82
  Top 0.254: R35.2 59.66,25.15 59.66,27.89 SV11.1
N$83
  Top 0.254: R34.2 35.66,25.15 35.66,27.89 SV10.1
N$84
  Top 0.254: R33.2 12.8,25.15 12.8,27.89 SV9.1
N$85
  Top 0.254: R14.2 17.83,6.63 17.83,3.89 SV13.3
N$86
  Top 0.254: R13.2 40.69,6.63 40.69,3.89 SV14.3
N$87
  Top 0.254: R15.2 64.92,6.63 64.92,3.89 SV15.3
N$88
  Top 0.254: R16.2 88.92,6.63 88.92,3.89 SV16.3
N$89
  Top 0.254: R32.2 86.41,6.63 86.41,3.89 SV16.2
N$90
  Top 0.254: R31.2 62.18,6.63 62.18,3.89 SV15.2
N$91
  Top 0.254: R30.2 38.18,6.63 38.18,3.89 SV14.2
N$92
  Top 0.254: R29.2 15.32,6.63 15.32,3.89 SV13.2
N$93
  Top 0.254: R40.2 83.9,6.63 83.9,3.89 SV16.1
N$94
  Top 0.254: R39.2 59.66,6.63 59.66,3.89 SV15.1
N$95
  Top 0.254: R38.2 35.66,6.63 35.66,3.89 SV14.1
N$96
  Top 0.254: R37.2 12.8,6.63 12.8,3.89 SV13.1
N$97  (via drill 0.61)
  Top 0.254: v48.92,62.41 48.92,60.58 50.29,59.21 52.58,59.21 IC7.1 | v59.89,62.41 62.64,62.41 v62.87,62.18 | v64.92,64.24 65.38,64.24 69.04,67.89 v80.92,67.89 | v81.15,26.29 81.15,31.55 U$1.A0
  Bottom 0.254: v59.89,62.41 v48.92,62.41 | v64.92,64.24 v62.87,62.18 | v80.92,67.89 80.92,67.21 97.16,50.98 97.16,29.03 96.47,28.35 93.95,28.35 93.27,29.03 92.35,29.03 89.38,26.06 81.38,26.06 v81.15,26.29
N$98
  Top 0.254: R53.2 5.03,10.29 5.03,7.77 Q1.3 | 7.54,7.77 JP1.1
  Top 0.61: 7.54,7.77 5.03,7.77
N$99
  Top 0.254: 31.55,7.77 JP2.1 | R54.2 29.26,10.29 29.26,7.77 Q2.3
  Top 0.61: 31.55,7.77 29.26,7.77
N$100
  Top 0.254: R55.2 53.26,10.29 53.26,7.77 Q3.3 | 55.78,7.77 JP3.1
  Top 0.61: 55.78,7.77 53.26,7.77
N$101
  Top 0.254: R56.2 77.5,10.29 77.5,7.77 Q4.3 | 80.01,7.77 JP4.1
  Top 0.61: 80.01,7.77 77.5,7.77
N$102
  Top 0.254: Q1.1 2.74,8.69 2.74,10.29 R49.2
N$103
  Top 0.254: Q2.1 26.75,8.69 26.75,10.29 R50.2
N$104
  Top 0.254: Q3.1 50.98,8.69 50.98,10.29 R51.2
N$105
  Top 0.254: Q4.1 74.98,8.69 74.98,10.29 R52.2
N$106  (via drill 0.61)
  Top 0.254: v52.12,70.41 54.41,68.12 54.41,61.49 53.26,60.35 52.81,60.35 IC7.2 | v58.29,70.41 60.58,70.41 61.04,70.87 61.04,77.5 61.72,78.18 69.27,78.18 v72.24,75.21
  Bottom 0.254: v58.29,70.41 v52.12,70.41 | v72.24,75.21 96.7,50.75 96.7,29.26 96.24,28.8 95.33,28.8 93.27,30.86 93.27,31.77 85.5,39.55 81.38,39.55 78.87,37.03 78.87,31.77 U$1.A1
N$107  (via drill 0.61)
  Top 0.254: v50.75,61.49 52.58,61.49 IC7.3 | v60.81,59.66 63.78,59.66 65.15,58.29 67.67,58.29 71.78,54.18 v71.78,52.12 | v72.69,43.2 72.69,41.83 74.3,40.23 74.3,33.6 76.12,31.77 U$1.A2
  Bottom 0.254: v50.75,61.49 58.98,61.49 v60.81,59.66 | v71.78,52.12 71.78,50.98 71.55,50.75 71.55,48.01 72.69,46.86 v72.69,43.2
Q1
  Top 0.254: R49.1 2.74,12.57 3.2,12.57 4.12,13.49 5.94,13.49 11.43,8 11.43,2.74 12.8,1.37 66.75,1.37 70.41,5.03 70.41,9.37 73.84,12.8 73.84,13.26 75.44,14.86 79.55,14.86 81.15,16.46 U$1.D9
Q2  (via drill 0.61)
  Top 0.254: v28.35,8.91 28.12,9.14 28.12,10.97 26.75,12.34 R50.1
  Bottom 0.254: v28.35,8.91 41.15,8.91 44.12,5.94 80.24,5.94 84.81,10.52 84.81,15.54 83.9,16.46 U$1.D10
Q3
  Top 0.254: U$1.D11 84.58,18.29 75.89,18.29 75.21,17.6 75.21,16 73.38,14.17 73.38,13.03 69.95,9.6 69.95,5.26 66.52,1.83 64.24,1.83 63.55,2.52 63.55,9.14 59.21,13.49 52.58,13.49 51.66,12.57 50.98,12.57 R51.1
VCC  (via drill 0.61)  (2 unrouted)
  Top 0.254: v7.54,45.72 6.86,46.41 6.86,49.38 C6.1 | v7.54,40.46 7.54,39.32 4.57,36.35 3.89,36.35 IC6.20 | v18.52,36.12 20.34,36.12 IC5.20 | 36.8,50.98 34.98,49.15 33.6,49.15 31.09,51.66 26.52,51.66 24.46,49.61 C5.1 24.46,49.38 25.83,48.01 v25.83,42.98 | 36.8,50.98 36.8,60.12 46.41,69.72 48.46,69.72 C7.1 48.69,69.72 48.69,68.58 51.66,65.61 52.58,65.61 IC7.6 | v89.61,44.58 91.67,46.63 91.67,49.38 C1.1 | IC1.20 86.41,36.35 85.5,36.35 84.58,37.26 v84.58,42.06 v82.3,44.35 | v69.49,49.38 73.84,49.38 C2.1 74.07,49.38 v74.07,47.32 | v66.29,39.09 66.29,37.49 67.67,36.12 69.72,36.12 IC2.20 | 43.66,50.75 43.66,56.24 46.41,58.98 IC7.16 | 43.66,50.75 43.66,49.61 C4.1 43.43,49.38 40.92,46.86 | 50.52,48.92 51.66,48.92 52.12,49.38 54.86,49.38 C3.1 | 50.52,48.92 48.69,50.75 43.66,50.75 | 40.92,46.86 40.01,45.95 40.01,34.75 39.09,33.83 38.18,33.83 37.03,34.98 37.03,36.12 IC4.20 | 54.41,34.52 54.41,35.2 53.49,36.12 IC3.20 53.26,36.35 52.58,36.35 49.84,39.09 49.84,43.2 50.52,43.89 50.52,48.92 | 54.41,34.52 54.41,29.03 57.15,26.29 57.15,22.63 60.58,19.2 60.58,18.29 59.89,17.6 59.89,15.77 58.98,14.86 48.92,14.86 47.78,13.72 47.78,8 50.06,5.71 51.89,5.71 52.12,5.94 52.12,11.2 53.26,12.34 R55.1 53.49,12.34 v54.86,12.34 | v79.1,12.34 77.5,12.34 R56.1 | 54.41,34.52 v57.15,34.52 | v38.63,49.15 36.8,50.98 | 40.92,46.86 v40.23,47.55
  Bottom 0.254: v7.54,45.72 v7.54,40.46 11.89,36.12 15.32,36.12 | 15.32,36.12 v18.52,36.12 | 15.32,36.12 15.32,40.92 17.83,43.43 25.38,43.43 v25.83,42.98 | v89.61,44.58 89.61,43.66 88.01,42.06 v84.58,42.06 | v69.49,49.38 69.49,48.01 62.64,41.15 62.64,39.09 | 62.64,39.09 62.64,33.83 61.04,32.23 | 61.04,32.23 61.04,31.77 U$1.5V 61.04,32.23 | 62.64,39.09 v66.29,39.09 | v82.3,44.35 77.04,44.35 v74.07,47.32 | v54.86,12.34 v79.1,12.34 | 61.04,32.23 58.75,34.52 v57.15,34.52 | v40.23,47.55 v38.63,49.15
Y0  (via drill 0.61)
  Top 0.254: v9.14,52.81 8,52.81 3.89,48.69 3.89,47.78 IC6.11 | v51.21,73.15 51.21,72.69 54.86,69.04 54.86,59.44 53.72,58.29 49.15,58.29 47.32,60.12 46.63,60.12 IC7.15
  Bottom 0.254: v9.14,52.81 9.83,52.81 30.18,73.15 v51.21,73.15
Y1  (via drill 0.61)
  Top 0.254: v27.66,54.86 20.57,47.78 IC5.11 | v44.58,60.35 45.72,61.49 46.41,61.49 IC7.14
  Bottom 0.254: v27.66,54.86 31.09,54.86 36.58,60.35 v44.58,60.35
Y2  (via drill 0.61)
  Top 0.254: IC7.13 45.49,62.87 v44.58,61.95 | v51.21,49.84 v48.23,52.81 | v51.66,48.01 53.03,48.01 53.26,47.78 IC3.11
  Bottom 0.254: v44.58,61.95 48.23,58.29 v48.23,52.81 | v51.21,49.84 51.21,48.46 v51.66,48.01
Y3
  Top 0.254: IC4.11 37.03,47.78 38.86,47.78 42.06,50.98 42.06,61.72 44.35,64.01 46.41,64.01 IC7.12
Y4  (via drill 0.61)
  Top 0.254: IC1.11 86.41,49.61 85.04,50.98 85.04,57.61 81.15,61.49 v69.95,61.49 | v48.23,65.15 46.86,65.15 46.63,65.38 IC7.11
  Bottom 0.254: v69.95,61.49 66.29,65.15 v48.23,65.15
Y5  (via drill 0.61)
  Top 0.254: v50.75,60.12 49.84,61.04 49.84,64.92 48.23,66.52 46.63,66.52 IC7.10 | v59.44,59.66 61.27,57.84 66.75,57.84 v68.35,56.24 | v68.35,48.69 68.81,48.69 69.72,47.78 IC2.11
  Bottom 0.254: v50.75,60.12 58.98,60.12 v59.44,59.66 | v68.35,48.69 v68.35,56.24

### Text on the board
tValues: V1.0 | V1.0 | Cube RGB 4x4x4 | Dylan Collaud